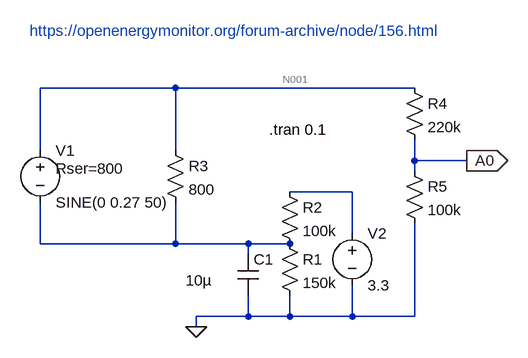
[diagram p0: schematic TA12 - ok.asc]
TA12 - ok.asc, the LTspice schematic file:
Version 4
SHEET 1 1372 680
WIRE -16 -480 -224 -480
WIRE 352 -480 -16 -480
WIRE -224 -384 -224 -480
WIRE -16 -384 -16 -480
WIRE 352 -368 352 -400
WIRE 432 -368 352 -368
WIRE 352 -352 352 -368
WIRE 256 -320 160 -320
WIRE 256 -256 256 -320
WIRE -224 -240 -224 -304
WIRE -16 -240 -16 -304
WIRE -16 -240 -224 -240
WIRE 96 -240 -16 -240
WIRE 160 -240 96 -240
WIRE 96 -224 96 -240
WIRE 96 -128 96 -160
WIRE 96 -128 16 -128
WIRE 160 -128 160 -160
WIRE 160 -128 96 -128
WIRE 256 -128 256 -176
WIRE 256 -128 160 -128
WIRE 352 -128 352 -272
WIRE 352 -128 256 -128
WIRE 16 -112 16 -128
FLAG 16 -112 0
FLAG 432 -368 A0
IOPIN 432 -368 Out
SYMBOL voltage -224 -400 R0
WINDOW 123 0 0 Left 0
WINDOW 39 24 44 Left 2
SYMATTR SpiceLine Rser=800
SYMATTR InstName V1
SYMATTR Value SINE(0 0.27 50)
SYMBOL res 144 -256 R0
SYMATTR InstName R1
SYMATTR Value 150k
SYMBOL cap 80 -224 R0
WINDOW 3 -80 40 Left 2
SYMATTR InstName C1
SYMATTR Value 10µ
SYMBOL res 144 -336 R0
SYMATTR InstName R2
SYMATTR Value 100k
SYMBOL voltage 256 -272 R0
WINDOW 123 0 0 Left 0
WINDOW 39 0 0 Left 0
SYMATTR InstName V2
SYMATTR Value 3.3
SYMBOL res -32 -400 R0
SYMATTR InstName R3
SYMATTR Value 800
SYMBOL res 336 -496 R0
SYMATTR InstName R4
SYMATTR Value 220k
SYMBOL res 336 -368 R0
SYMATTR InstName R5
SYMATTR Value 100k
TEXT 128 -416 Left 2 !.tran 0.1
TEXT -240 -568 Left 2 ;https://openenergymonitor.org/forum-archive/node/156.html

The netlist it stands for:
* TA12 - ok.asc
V1 N001 N003 SINE(0 0.27 50) Rser=800
R1 N003 0 150k
C1 N003 0 10µ
R2 N002 N003 100k
V2 N002 0 3.3
R3 N001 N003 800
R4 N001 A0 220k
R5 A0 0 100k
.tran 0.1
* https://openenergymonitor.org/forum-archive/node/156.html
.backanno
.end

* Results of the author's LTspice run, read from the files saved beside the schematic
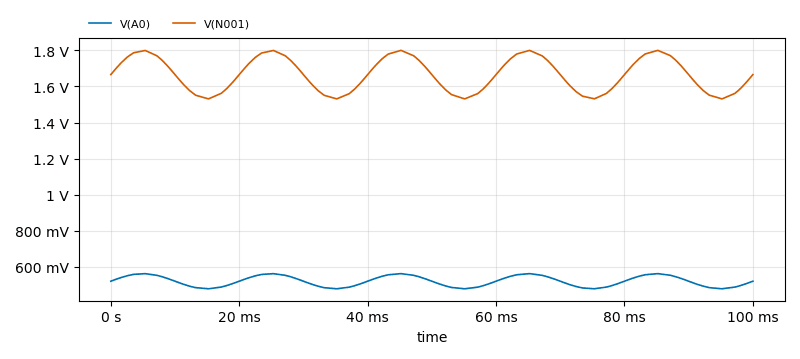
[diagram p1: Transient Analysis of TA12 - ok.asc, plotted from the saved traces]
* Transient Analysis, 1 run:
*   V(A0): min 478.4 mV, max 562.5 mV, average 520.5 mV, rms 521.3 mV, last 520.5 mV
*   V(N001): min 1.531 V, max 1.8 V, average 1.666 V, rms 1.668 V, last 1.666 V